# EAGLE design tcam_mini_eth_base (EAGLE 7.7.0)
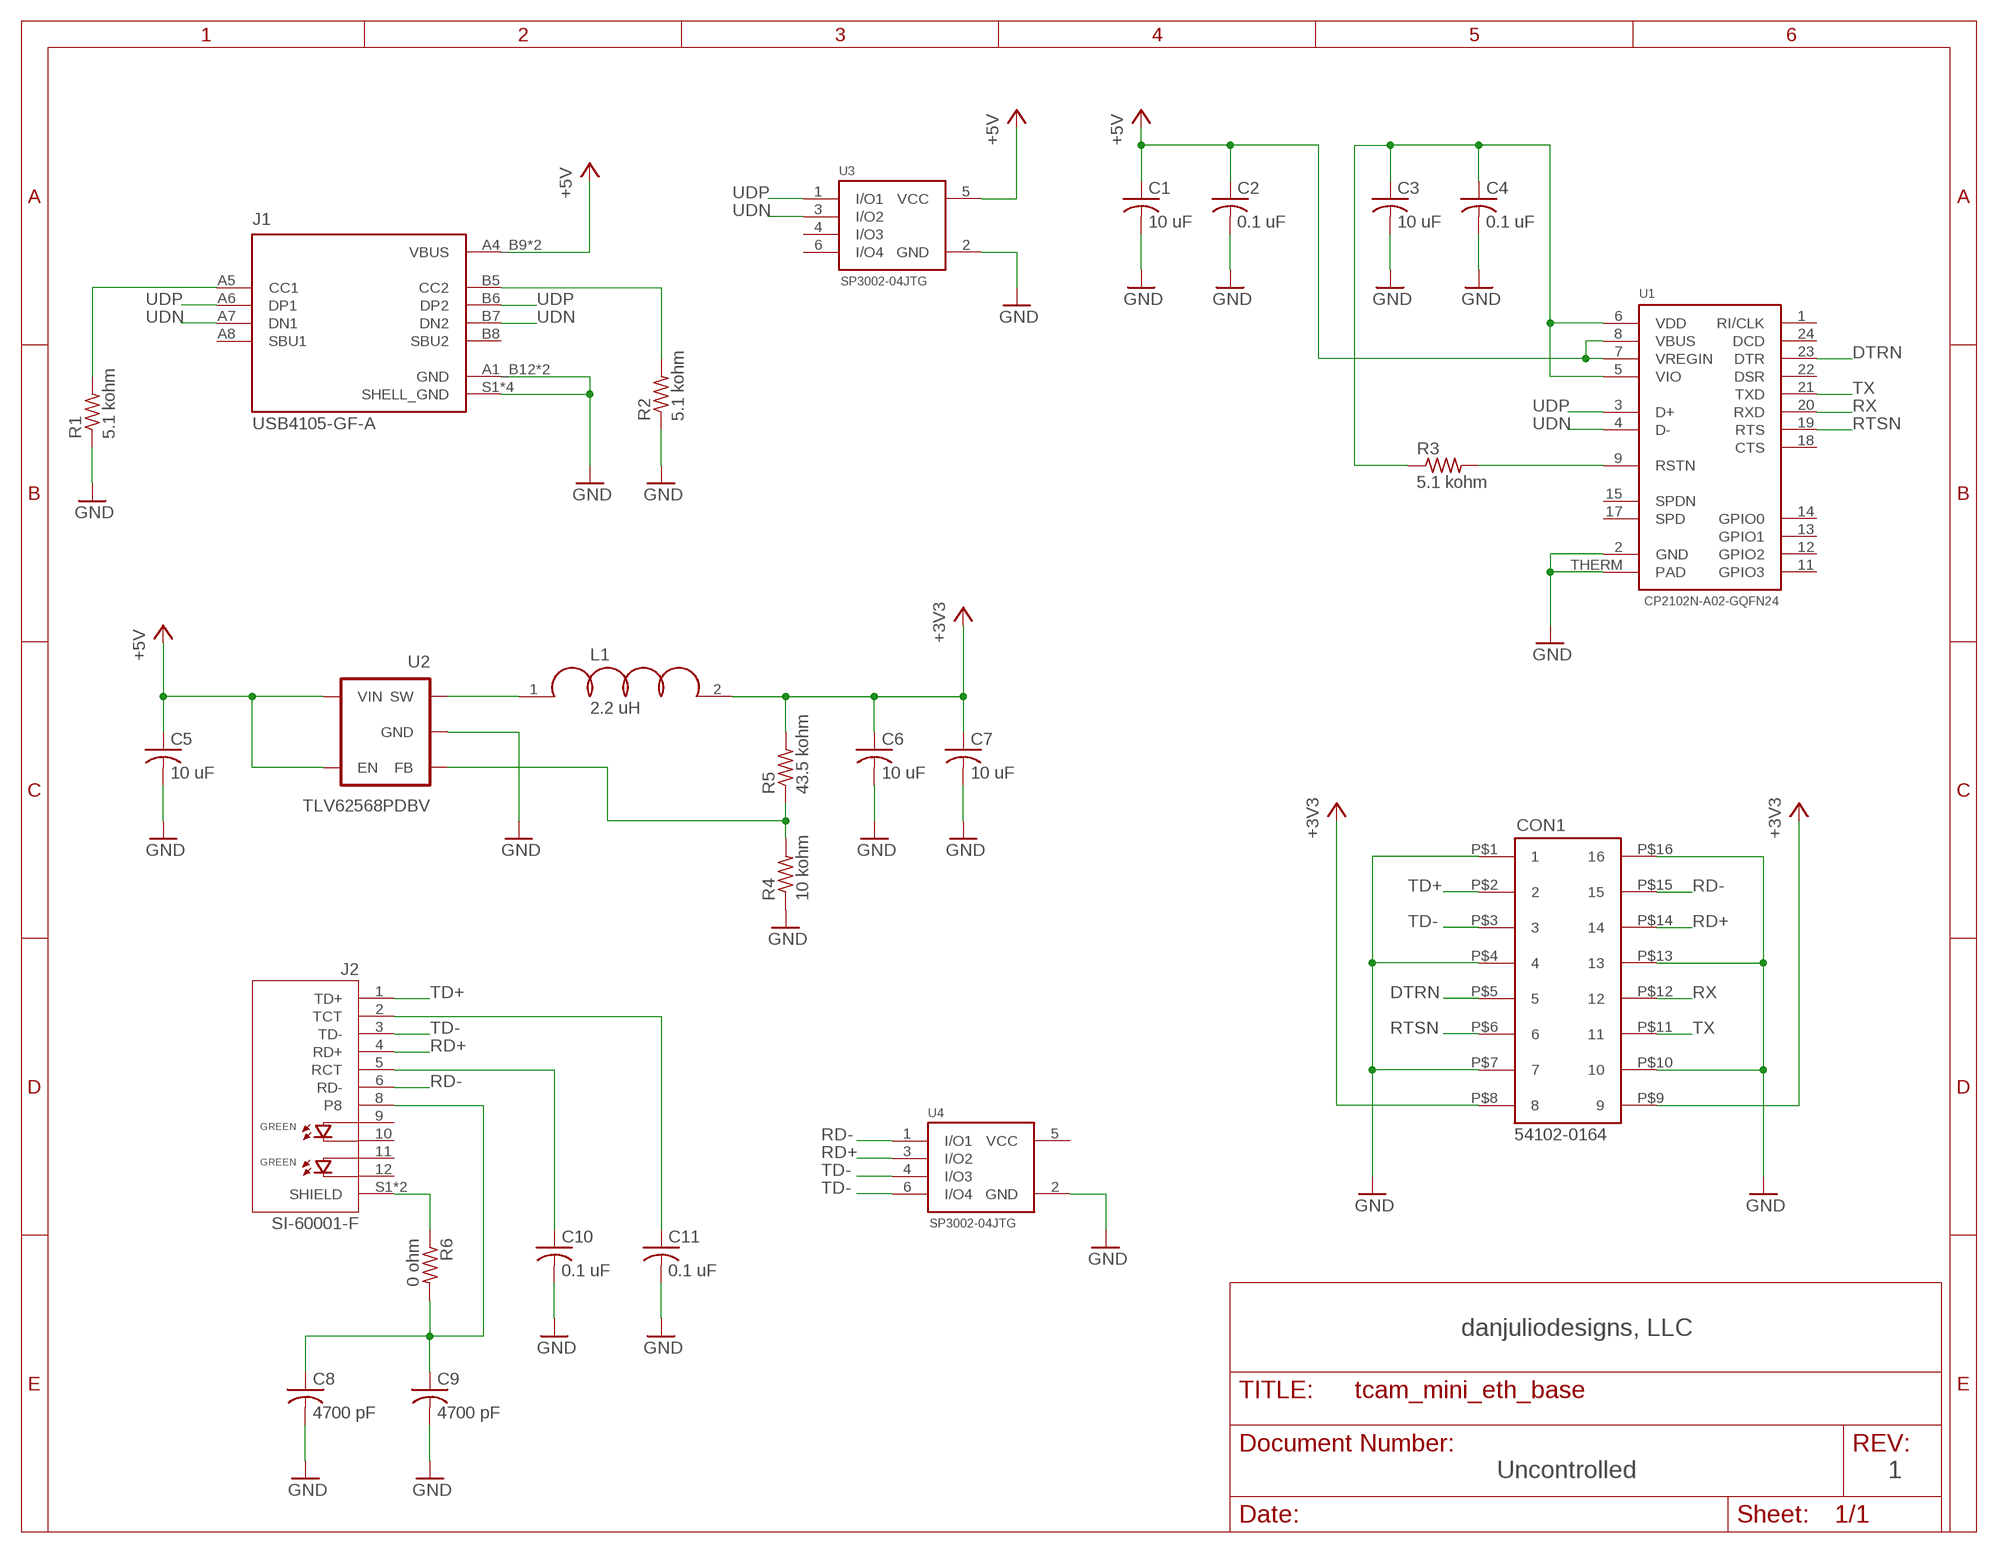
[diagram p0: schematic, sheet 1]

## Parts
C1  10 uF  C-USSMT0603  [C0603]
C2  0.1 uF  C-USSMT0603  [C0603]
C3  10 uF  C-USSMT0603  [C0603]
C4  0.1 uF  C-USSMT0603  [C0603]
C5  10 uF  C-USSMT0603  [C0603]
C6  10 uF  C-USSMT0603  [C0603]
C7  10 uF  C-USSMT0603  [C0603]
C8  4700 pF  C-USSMT1210  [C1210]
C9  4700 pF  C-USSMT1210  [C1210]
C10  0.1 uF  C-USSMT0603  [C0603]
C11  0.1 uF  C-USSMT0603  [C0603]
CON1  54102-0164  MOLEX_54102_0164  [MOLEX_54102_0164]
J1  USB4105-GF-A  [GCT_USB4105-GF-A]
J2  SI-60001-F  [BEL_SI-60001-F]
L1  2.2 uH  INDUCTORSMT1008  [L1008]
R1  5.1 kohm  R-USSMT0603  [R0603]
R2  5.1 kohm  R-USSMT0603  [R0603]
R3  5.1 kohm  R-USSMT0603  [R0603]
R4  10 kohm  R-USSMT0603  [R0603]
R5  43.5 kohm  R-USSMT0603  [R0603]
R6  0 ohm  R-USSMT0805  [R0805]
U1  CP2102N-A02-GQFN24  CP2102N_QFN24  [QFN24]
U2  TLV62568PDBV  TLV62568DBV  [SOT23-5]
U3  SP3002-04JTG  [SOT65P220X95-6N]
U4  SP3002-04JTG  [SOT65P220X95-6N]

## Nets
+3V3: C6.1 C7.1 CON1.P$8 CON1.P$9 L1.2 R5.2
+5V: C1.1 C2.1 C5.1 J1.A4_B9(VBUS) J1.B4_A9(VBUS) U1.7(VREGIN) U1.8(VBUS) U2.1(EN) U2.4(VIN) U3.5(VCC)
DTRN: CON1.P$5 U1.23(DTR)
GND: C1.2 C2.2 C3.2 C4.2 C5.2 C6.2 C7.2 C8.2 C9.2 C10.2 C11.2 CON1.P$1 CON1.P$4 CON1.P$7 CON1.P$10 CON1.P$13 CON1.P$16 J1.A1_B12(GND) J1.B1_A12(GND) J1.S1(SHELL_GND) J1.S2(SHELL_GND) J1.S3(SHELL_GND) J1.S4(SHELL_GND) R1.1 R2.1 R4.1 U1.2(GND) U1.THERM(PAD) U2.2(GND) U3.2(GND) U4.2(GND)
N$1: J1.A5(CC1) R1.2
N$2: J1.B5(CC2) R2.2
N$3: L1.1 U2.3(SW)
N$4: R4.2 R5.1 U2.5(FB)
N$6: R3.2 U1.9(RSTN)
N$7: C10.1 J2.5(RCT)
N$8: C11.1 J2.2(TCT)
N$12: J2.S1(SHIELD) J2.S2(SHIELD) R6.1
N$13: C8.1 C9.1 J2.8 R6.2
RD+: CON1.P$14 J2.4(RD+) U4.3(I/O2)
RD-: CON1.P$15 J2.6(RD-) U4.1(I/O1)
RTSN: CON1.P$6 U1.19(RTS)
RX: CON1.P$12 U1.20(RXD)
TD+: CON1.P$2 J2.1(TD+) U4.6(I/O4)
TD-: CON1.P$3 J2.3(TD-) U4.4(I/O3)
TX: CON1.P$11 U1.21(TXD)
UDN: J1.A7(DN1) J1.B7(DN2) U1.4(D-) U3.3(I/O2)
UDP: J1.A6(DP1) J1.B6(DP2) U1.3(D+) U3.1(I/O1)
VDD: C3.1 C4.1 R3.1 U1.5(VIO) U1.6(VDD)
Unconnected: J1.A8(SBU1) J1.B8(SBU2) J2.9(GA1) J2.10(GK1) J2.11(GA2) J2.12(GK2) U1.1(RI/CLK) U1.11(GPIO3) U1.12(GPIO2) U1.13(GPIO1) U1.14(GPIO0) U1.15(SPDN) U1.17(SPD) U1.18(CTS) U1.22(DSR) U1.24(DCD) U3.4(I/O3) U3.6(I/O4)

## Notes on the sheet
- danjuliodesigns, LLC
- Uncontrolled | 1

## Power pins joined to a net without a drawn wire
VCC: U4.5(VCC)

## Library data of the parts
C1-C11 = djd_eagle_library:C-US
CON1 = djd_eagle_library:MOLEX_54102_0164: Molex 54102-0164 0.5 mm 2 row 16 circuit board-to-board plug
J1 = USB4105-GF-A:USB4105-GF-A: USB-C (USB TYPE-C) USB 2.0 Receptacle Connector 24 (16+8 Dummy) Position Surface Mount, Right Angle; Through Hole Check prices <https://pricing.snapeda.com/parts/USB4105-GF-A/GCT/view-part?ref=eda>; AVAILABILITY: In Stock; DESCRIPTION: USB-C (USB TYPE-C) USB 2.0 Receptacle Connector 24 (16+8 Dummy) Position Surface Mount, Right Angle; Through Hole; MF: GCT; MP: USB4105-GF-A; PACKAGE: None; PRICE: None
J2 = SI-60001-F:SI-60001-F: MagJack 10/100BASE-T | 1X1 | G/G | Tab Down | RoHS Check availability <https://pricing.snapeda.com/parts/SI-60001-F/Stewart%20Connector/view-part?ref=eda>; AVAILABILITY: In Stock; CHECK_PRICES: https://www.snapeda.com/parts/SI-60001-F/Stewart+Connector/view-part/?ref=eda; DESCRIPTION: 1 Port RJ45 Magjack Connector Through Hole 10/100 Base-T, AutoMDIX; MF: Stewart Connector; MP: SI-60001-F; PACKAGE: None; PRICE: None; SNAPEDA_LINK: https://www.snapeda.com/parts/SI-60001-F/Stewart+Connector/view-part/?ref=snap
L1 = djd_eagle_library:INDUCTOR
R1-R6 = djd_eagle_library:R-US
U1 = djd_eagle_library:CP2102N_QFN24
U2 = djd_eagle_library:TLV62568DBV: TI 5-pin 2.5V-5.5V input, 1A high efficiency step-down buck converter
U3 U4 = SP3002-04JTG:SP3002-04JTG: SP3002 Series 13 V 0.85 pF Low Capacitance ESD Protection Array - SC-70-6 Check availability <https://pricing.snapeda.com/parts/SP3002-04JTG/Littelfuse%20Inc./view-part?ref=eda>; AVAILABILITY: In Stock; DESCRIPTION: 13V Clamp 4.5A (8/20µs) Ipp Tvs Diode Surface Mount SC-70-6; MF: Littelfuse Inc.; MP: SP3002-04JTG; PACKAGE: SC-70-6 Littelfuse; PRICE: None; PURCHASE-URL: https://pricing.snapeda.com/search/part/SP3002-04JTG/?ref=eda

## Board
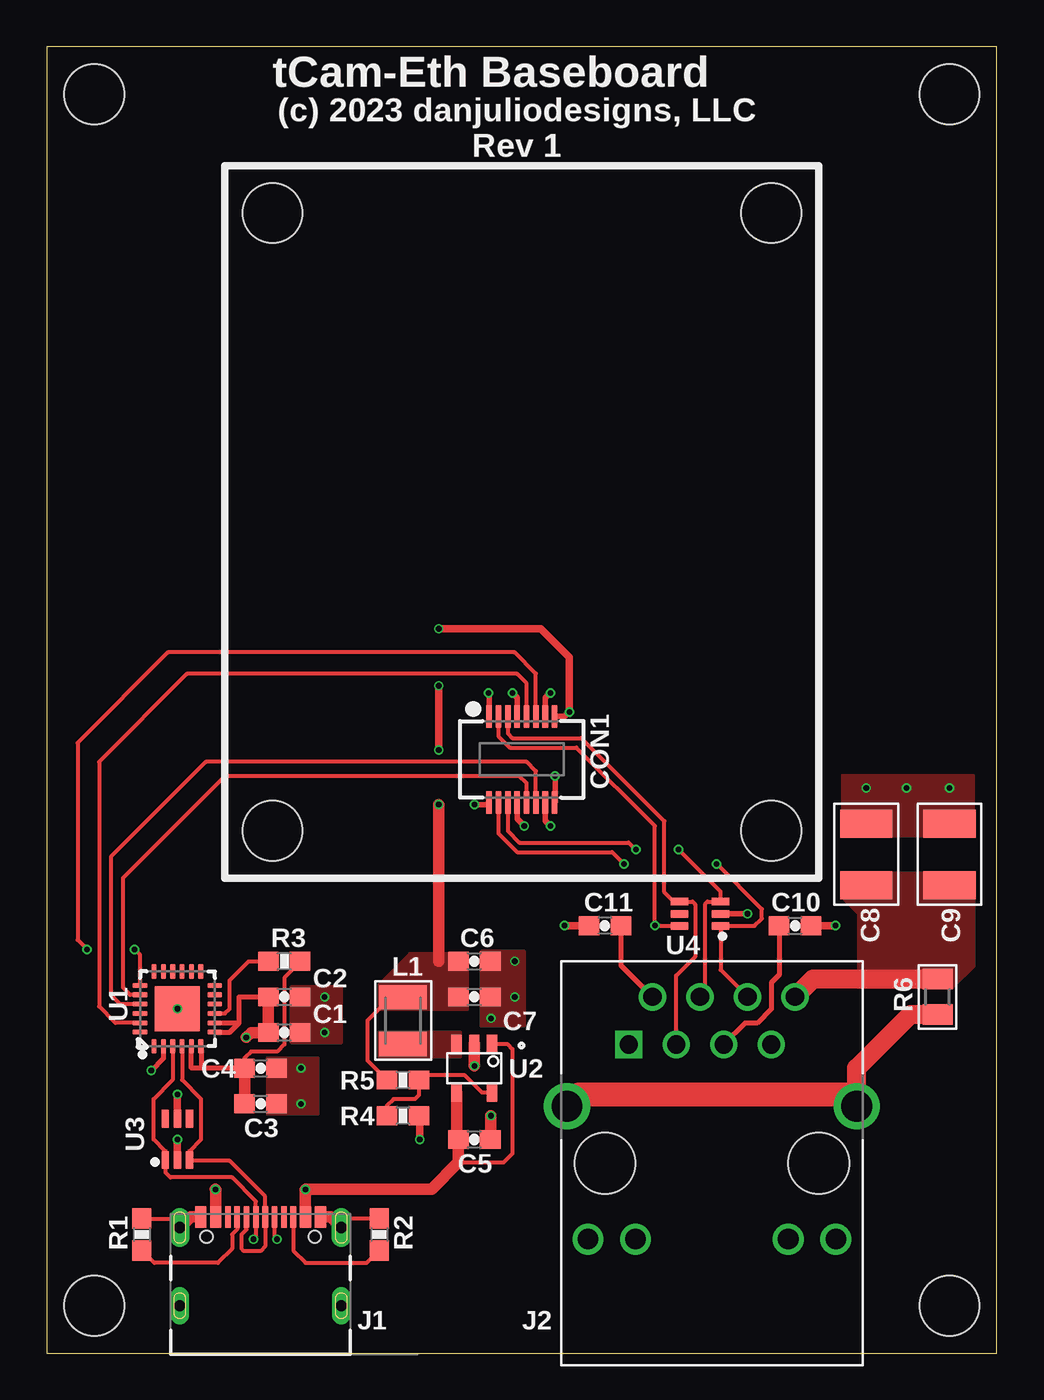
[diagram p1: board, top side]
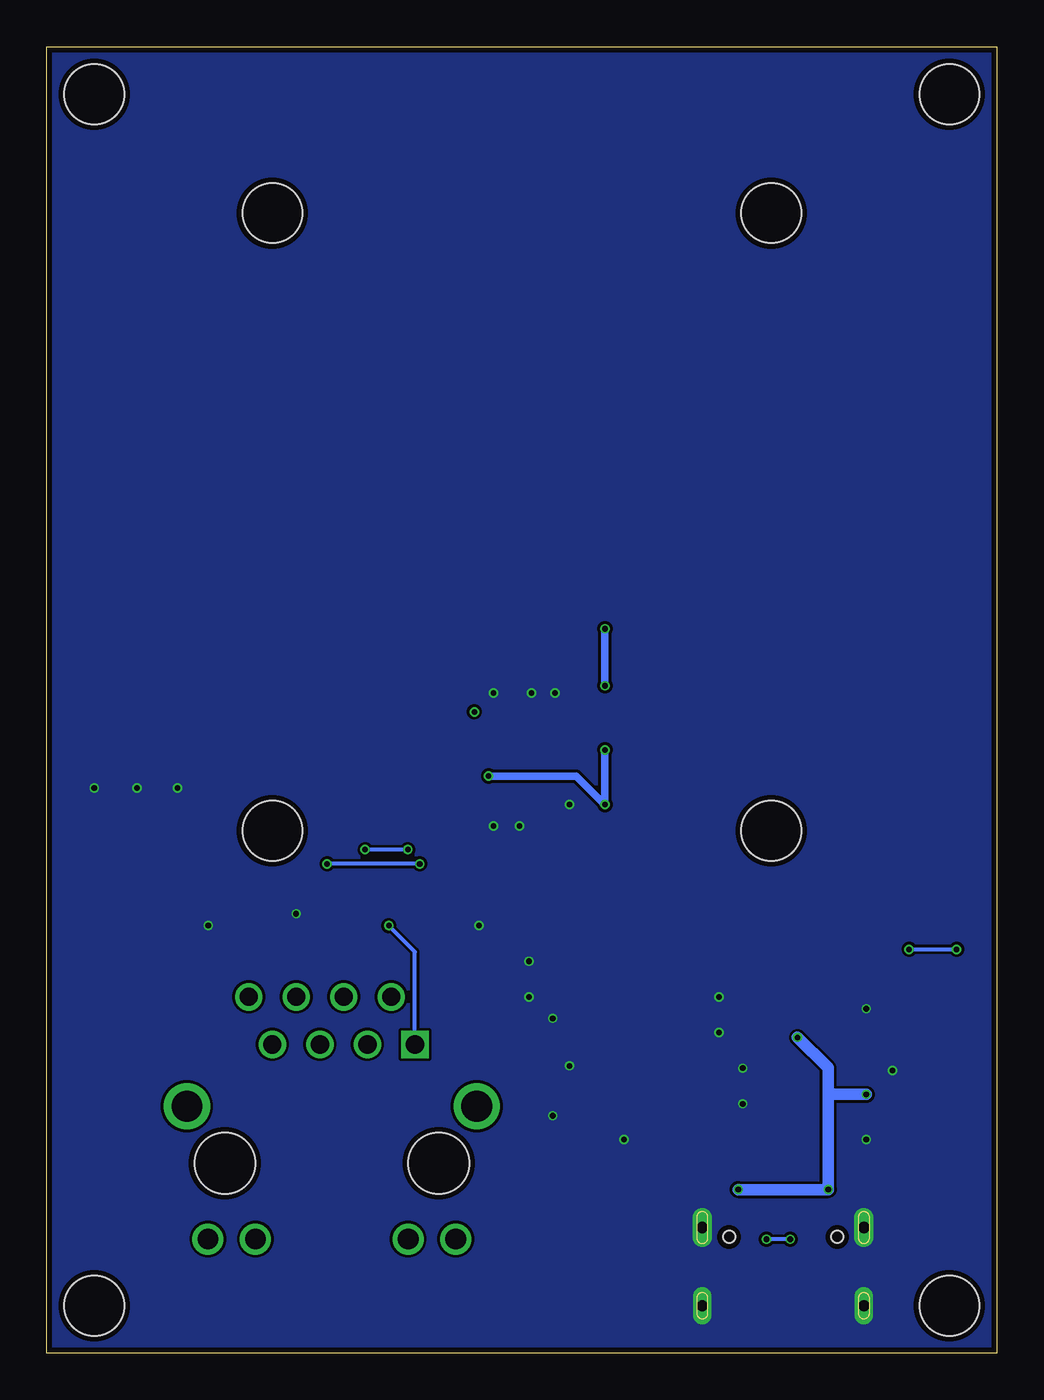
[diagram p2: board, bottom side, seen from below]

Size 50.8 x 69.85 mm. Coordinates in mm from the lower left corner, seen from the top.
Outline: 0,0 50.8,0 50.8,69.85 0,69.85 0,0
Copper layers (1*16): Top 0.035mm / dielectric 1.5mm / Bottom 0.035mm
Design rules "PCBWay_2L_152um-Track": minimum track width 6mil, minimum drill 0.3mm, track to track 6mil, track to pad 6mil, pad to pad 6mil, via to via 6mil, smd to smd 0mil, copper to edge 0.3mm, drill to drill 10mil, minimum pad ring 6mil, minimum via ring 0.1mm, stop-mask expansion 2mil, vias tented up to drill 0.45mm, thermal gap 0.2mm
Holes 3.2 mm at 2.54,2.54 48.26,2.54 12.06,27.94 38.73,27.94 12.06,60.96 38.73,60.96 2.54,67.31 48.26,67.31

### Footprints (pad centres in the part's own frame; a part is rotated, then mirrored left to right if it is on the bottom)
C0603 = smd 1.1 x 1: 1 -0.85,0; 2 0.85,0
C1210 = smd 2.8 x 1.5: 1 0,-1.65; 2 0,1.65
MOLEX_54102_0164 = smd 1.2 x 0.3: P$1 2.3,1.75; P$2 2.3,1.25; P$3 2.3,0.75; P$4 2.3,0.25; P$5 2.3,-0.25; P$6 2.3,-0.75; P$7 2.3,-1.25; P$8 2.3,-1.75; P$9 -2.3,-1.75; P$10 -2.3,-1.25; P$11 -2.3,-0.75; P$12 -2.3,-0.25; P$13 -2.3,0.25; P$14 -2.3,0.75; P$15 -2.3,1.25; P$16 -2.3,1.75
GCT_USB4105-GF-A = smd 0.6 x 1.15: A1_B12 -3.2,4.755; A4_B9 -2.4,4.755; B1_A12 3.2,4.755; B4_A9 2.4,4.755 | smd 0.3 x 1.15: A5 -1.25,4.755; A6 -0.25,4.755; A7 0.25,4.755; A8 1.25,4.755; B5 1.75,4.755; B6 0.75,4.755; B7 -0.75,4.755; B8 -1.75,4.755 | drill 0.6 pad 1.05 long: S1 -4.32,4.18; S4 4.32,4.18 | drill 0.6 pad 1 long: S2 -4.32,0; S3 4.32,0 | hole 0.65: 2.89,3.68; -2.89,3.68
BEL_SI-60001-F = drill 0.97 square: 1 -4.445,6.35 | drill 0.97: 2 -3.175,8.89; 3 -1.905,6.35; 4 -0.635,8.89; 5 0.635,6.35; 6 1.905,8.89; 7 3.175,6.35; 8 4.445,8.89 | drill 1.1: 9 -6.625,-4.06; 10 -4.085,-4.06; 11 4.085,-4.06; 12 6.625,-4.06 | drill 1.65: S1 -7.745,3.05; S2 7.745,3.05 | hole 3.25: 5.715,0; -5.715,0
L1008 = smd 1.3 x 2.55: 1 -1.25,0; 2 1.25,0
R0603 = smd 1.1 x 1: 1 -0.85,0; 2 0.85,0
R0805 = smd 1.1 x 1.6: 1 -0.95,0; 2 0.95,0
QFN24 = smd 0.8 x 0.28: 1 -2,1.25; 2 -2,0.75; 3 -2,0.25; 4 -2,-0.25; 5 -2,-0.75; 6 -2,-1.25; 13 2,-1.25; 14 2,-0.75; 15 2,-0.25; 16 2,0.25; 17 2,0.75; 18 2,1.25 | smd 0.28 x 0.8: 7 -1.25,-2; 8 -0.75,-2; 9 -0.25,-2; 10 0.25,-2; 11 0.75,-2; 12 1.25,-2; 19 1.25,2; 20 0.75,2; 21 0.25,2; 22 -0.25,2; 23 -0.75,2; 24 -1.25,2 | smd 2.4 x 2.4: THERM 0,0
SOT23-5 = smd 0.55 x 1: 1 -0.95,-1.3; 2 0,-1.3; 3 0.95,-1.3; 4 0.95,1.3; 5 -0.95,1.3
SOT65P220X95-6N = smd 0.95 x 0.4: 1 -1.1,0.65; 2 -1.1,0; 3 -1.1,-0.65; 4 1.1,-0.65; 5 1.1,0; 6 1.1,0.65

### Placement (x,y rotation side)
C1  12.7,17.14 0 top
C2  12.7,19.05 0 top
C3  11.43,13.34 0 top
C4  11.43,15.24 0 top
C5  22.86,11.43 0 top
C6  22.86,20.95 0 top
C7  22.86,19.05 0 top
C8  43.81,26.67 0 top
C9  48.26,26.67 0 top
C10  40.01,22.86 0 top
C11  29.84,22.86 180 top
CON1  25.4,31.75 90 top
J1  11.43,2.54 0 top
J2  35.56,10.16 0 top
L1  19.05,17.78 90 top
R1  5.08,6.35 270 top
R2  17.78,6.35 270 top
R3  12.7,20.95 180 top
R4  19.05,12.7 180 top
R5  19.05,14.61 180 top
R6  47.62,19.05 90 top
U1  6.99,18.41 90 top
U2  22.86,15.24 180 top
U3  6.99,11.43 90 top
U4  34.92,23.5 180 top

### Tracks (layer width: path | path; a pad name or v marks a point on that pad's centre or on a via)
+3V3  (via drill 0.3)
  Top 0.203: L1.2 18.39,19.03 17.14,17.78 17.14,15.66 R5.2
  Top 0.305: CON1.P$8 27.7,34.05 v27.94,34.29 | v27.18,30.86 27.18,29.48 CON1.P$9
  Top 0.406: v27.94,34.29 27.94,37.21 26.42,38.73 v20.95,38.73 | v20.95,35.69 v20.95,32.26
  Top 0.61: v20.95,29.34 20.95,20.95
  Bottom 0.406: v27.18,30.86 22.48,30.86 v20.95,29.34 v20.95,32.26 | v20.95,38.73 v20.95,35.69
  pour Top (no thermals): 17.78,18.41 22.48,18.41 22.48,21.34 19.43,21.34 17.78,19.68
+5V  (via drill 0.3)
  Top 0.203: U2.1 24.61,16.54 24.89,16.26 24.89,10.67 24.42,10.2 22.01,10.2
  Top 0.254: 10.29,17.66 10.29,19.05 C2.1 | U1.8 10.29,17.66 | U1.7 9.79,17.16 10.29,17.66
  Top 0.406: U3.5 v6.99,13.84
  Top 0.61: U2.4 21.91,11.53 C5.1 22.01,10.2 20.57,8.76 13.84,8.76 v13.83,8.75 J1.B4_A9 | J1.A4_B9 v9.03,8.75 v9.02,8.76 | C2.1 C1.1 10.92,17.14 v10.67,16.89
  Bottom 0.61: v13.83,8.75 v9.03,8.75 | v9.03,8.75 v9.02,8.76 | v9.03,8.75 9.03,13.84 | 9.03,13.84 v6.99,13.84 | 9.03,13.84 9.03,15.25 v10.67,16.89
DTRN
  Top 0.203: CON1.P$5 25.65,35.82 25.15,36.32 7.49,36.32 2.79,31.62 2.79,18.54 3.67,17.66 U1.23
GND  (via drill 0.3)
  Top 0.203: R1.1 6.63,7.2 J1.S1 | R2.1 16.23,7.2 J1.S4
  Top 0.254: U1.2 6.24,15.76 v5.59,15.11
  Top 0.305: CON1.P$4 25.15,35.05 v24.89,35.31 | CON1.P$1 23.65,35.28 v23.62,35.31 | CON1.P$7 26.65,35.03 v26.92,35.31 | v22.86,29.34 23.54,29.34 CON1.P$16 | CON1.P$13 25.15,28.57 v25.53,28.19 | CON1.P$10 26.65,28.47 v26.92,28.19 | U4.2 v37.47,23.5
  Top 0.406: v19.94,11.43 19.94,12.66 R4.1 | U3.2 v6.99,11.43 | C11.2 v27.69,22.86 | v42.16,22.86 C10.2
  Top 0.61: v22.86,15.37 U2.2 | v23.75,12.7 23.75,11.47 C5.2 | J1.B1_A12 15.18,7.29 J1.S4 | J1.A1_B12 7.68,7.29 J1.S1
  other vias: 23.75,17.91 25.02,19.05 25.02,20.95 14.86,19.05 14.86,17.14 13.59,15.24 13.59,13.34 6.99,18.41 43.81,30.23 45.97,30.23 48.26,30.23
  pour Bottom (no thermals): 0,0 50.8,0 50.8,69.85 0,69.85
  pour Top (no thermals): 23.24,21.46 23.24,17.53 25.53,17.53 25.53,21.46
  pour Top (no thermals): 11.81,12.83 14.48,12.83 14.48,15.75 11.81,15.75
  pour Top (no thermals): 13.08,16.64 15.75,16.64 15.75,19.56 13.08,19.56
  pour Top (no thermals): 42.55,27.69 49.53,27.69 49.53,30.86 42.55,30.86
N$1
  Top 0.203: J1.A5 10.18,6.62 9.91,6.35 9.91,5.59 9.14,4.83 5.75,4.83 R1.2
N$2
  Top 0.203: J1.B5 13.18,5.49 13.84,4.83 17.11,4.83 R2.2
N$3
  pour Top (no thermals): 17.78,15.88 22.1,15.88 22.1,17.14 17.78,17.14
N$4
  Top 0.203: R4.2 18.2,13.25 18.54,13.59 19.68,13.59 19.9,13.8 R5.1 20.15,14.86 22.35,14.86 23.27,13.94 U2.5
N$6
  Top 0.203: U1.9 9.53,18.16 9.78,18.41 9.78,19.94 10.79,20.95 R3.2
N$7
  Top 0.254: C10.1 39.16,20.23 38.73,19.81 38.73,18.41 37.97,17.65 37.34,17.65 J2.5
N$8
  Top 0.254: C11.1 30.7,20.74 J2.2
N$12
  Top 1.016: J2.S2 43.3,15.24 46.17,18.1 R6.1
  Top 1.27: J2.S1 28.45,13.84 42.67,13.84 J2.S2
N$13
  Top 1.016: R6.2 40.95,20 J2.8
  pour Top (no thermals): 42.55,25.65 49.53,25.65 49.53,20.7 48.39,19.56 43.43,19.56 43.43,23.5 42.55,24.38
RD+  (via drill 0.3)
  Top 0.203: CON1.P$14 24.65,27.93 25.27,27.3 31.11,27.3 v31.5,26.92 | J2.4 35.18,19.3 35.18,24 35.32,24.14 U4.3 36.02,24.68 v33.78,26.92
  Bottom 0.203: v31.5,26.92 v33.78,26.92
RD-  (via drill 0.3)
  Top 0.203: CON1.P$15 24.15,27.79 25.15,26.8 30.23,26.8 v30.86,26.16 | J2.6 36.02,20.49 U4.1 37.83,22.84 38.23,23.24 38.23,23.75 v35.81,26.16
  Bottom 0.203: v30.86,26.16 v35.81,26.16
RTSN  (via drill 0.3)
  Top 0.203: CON1.P$6 26.15,36.33 25.02,37.47 6.48,37.47 1.65,32.64 1.65,22.1 v2.16,21.59 | U1.19 4.99,21.3 v4.7,21.59
  Bottom 0.203: v4.7,21.59 v2.16,21.59
RX
  Top 0.203: CON1.P$12 25.65,30.48 25.27,30.86 9.53,30.86 4.06,25.4 4.06,19.56 4.46,19.16 U1.20
TD+  (via drill 0.3)
  Top 0.203: CON1.P$2 24.15,33 24.77,32.38 28.32,32.38 32.51,28.19 v32.51,22.86 U4.6
  Bottom 0.203: J2.1 31.11,21.46 v32.51,22.86
TD-
  Top 0.203: CON1.P$3 24.65,33.13 24.89,32.89 28.57,32.89 33.02,28.45 33.02,24.64 33.51,24.14 U4.4 34.53,24.14 34.67,24 34.67,21.21 33.66,20.19 J2.3
TX
  Top 0.203: CON1.P$11 26.15,31.13 25.65,31.62 8.51,31.62 3.43,26.54 3.43,19.18 3.94,18.66 U1.21
UDN
  Top 0.203: U1.4 7.24,14.61 8.26,13.59 8.26,11.43 7.63,10.81 U3.3 7.68,10.29 9.78,10.29 11.68,8.39 J1.A7 11.68,5.71 11.43,5.46 10.54,5.46 10.41,5.59 10.41,6.35 10.67,6.6 10.67,7.28 J1.B7
UDP  (via drill 0.3)
  Top 0.203: U1.3 6.74,14.61 5.71,13.59 5.71,11.43 6.33,10.81 U3.1 6.35,10.31 6.35,9.65 6.6,9.4 9.91,9.4 11.18,8.12 J1.A6 11.18,6.23 v11.05,6.1 | v12.32,6.1 12.19,6.22 12.19,7.28 J1.B6
  Bottom 0.203: v11.05,6.1 v12.32,6.1
VDD
  Top 0.203: U1.6 8.26,16.41 | R3.1 13.55,20.92 12.7,20.07 12.7,16.51 12.32,16.13 10.92,16.13 10.58,15.79 C4.1
  Top 0.254: C4.1 8.26,15.24 | 8.26,15.24 7.74,15.24 U1.5 | 8.26,16.41 8.26,15.24
  Top 0.61: C3.1 C4.1

### Text on the board
tPlace: tCam-Eth Baseboard
tNames: (c) 2023 danjuliodesigns, LLC / Rev 1